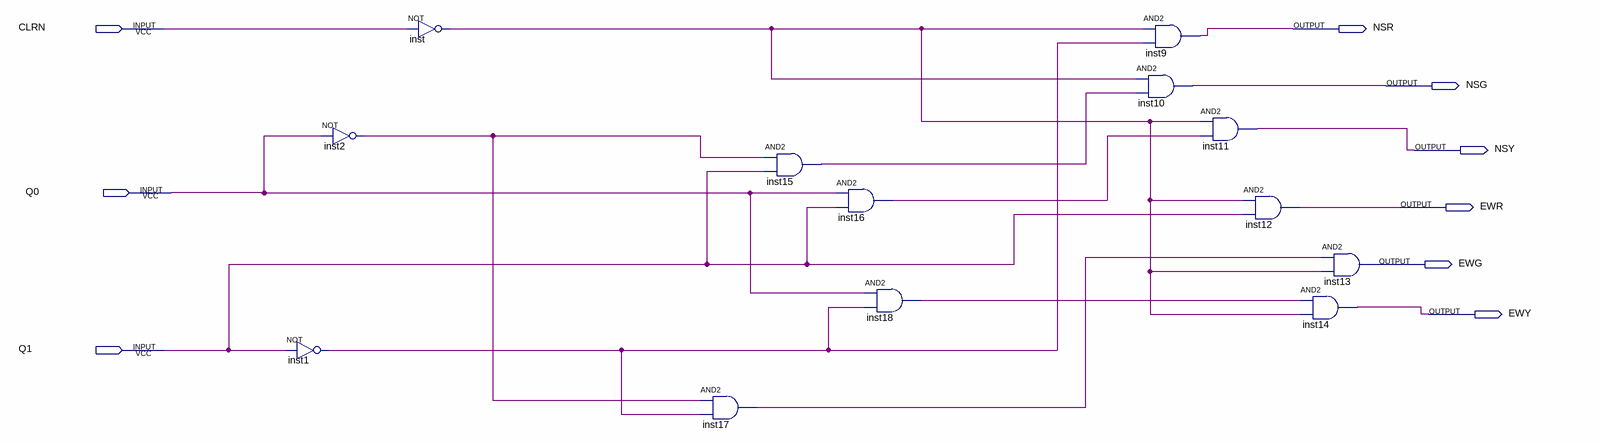
[diagram p0: schematic sheet]
// Quartus schematic TL.bdf as structural Verilog: 13 symbols, 9 pins
module TL (
  input  CLRN,
  input  Q0,
  input  Q1,
  output NSR,
  output NSG,
  output NSY,
  output EWR,
  output EWG,
  output EWY
);

  wire inst1_out, inst2_out, inst15_out, inst16_out, inst17_out, inst18_out, inst_out;

  not inst1 (inst1_out, Q1);
  not inst2 (inst2_out, Q0);
  not inst (inst_out, CLRN);
  and inst17 (inst17_out, inst2_out, inst1_out);
  and inst15 (inst15_out, inst2_out, Q1);
  and inst16 (inst16_out, Q0, Q1);
  and inst18 (inst18_out, Q0, inst1_out);
  and inst9 (NSR, inst_out, inst1_out);
  and inst10 (NSG, inst_out, inst15_out);
  and inst11 (NSY, inst_out, inst16_out);
  and inst12 (EWR, inst_out, Q1);
  and inst13 (EWG, inst17_out, inst_out);
  and inst14 (EWY, inst18_out, inst_out);
endmodule
